# EAGLE design CNT_1_1 (EAGLE 8.3.2)
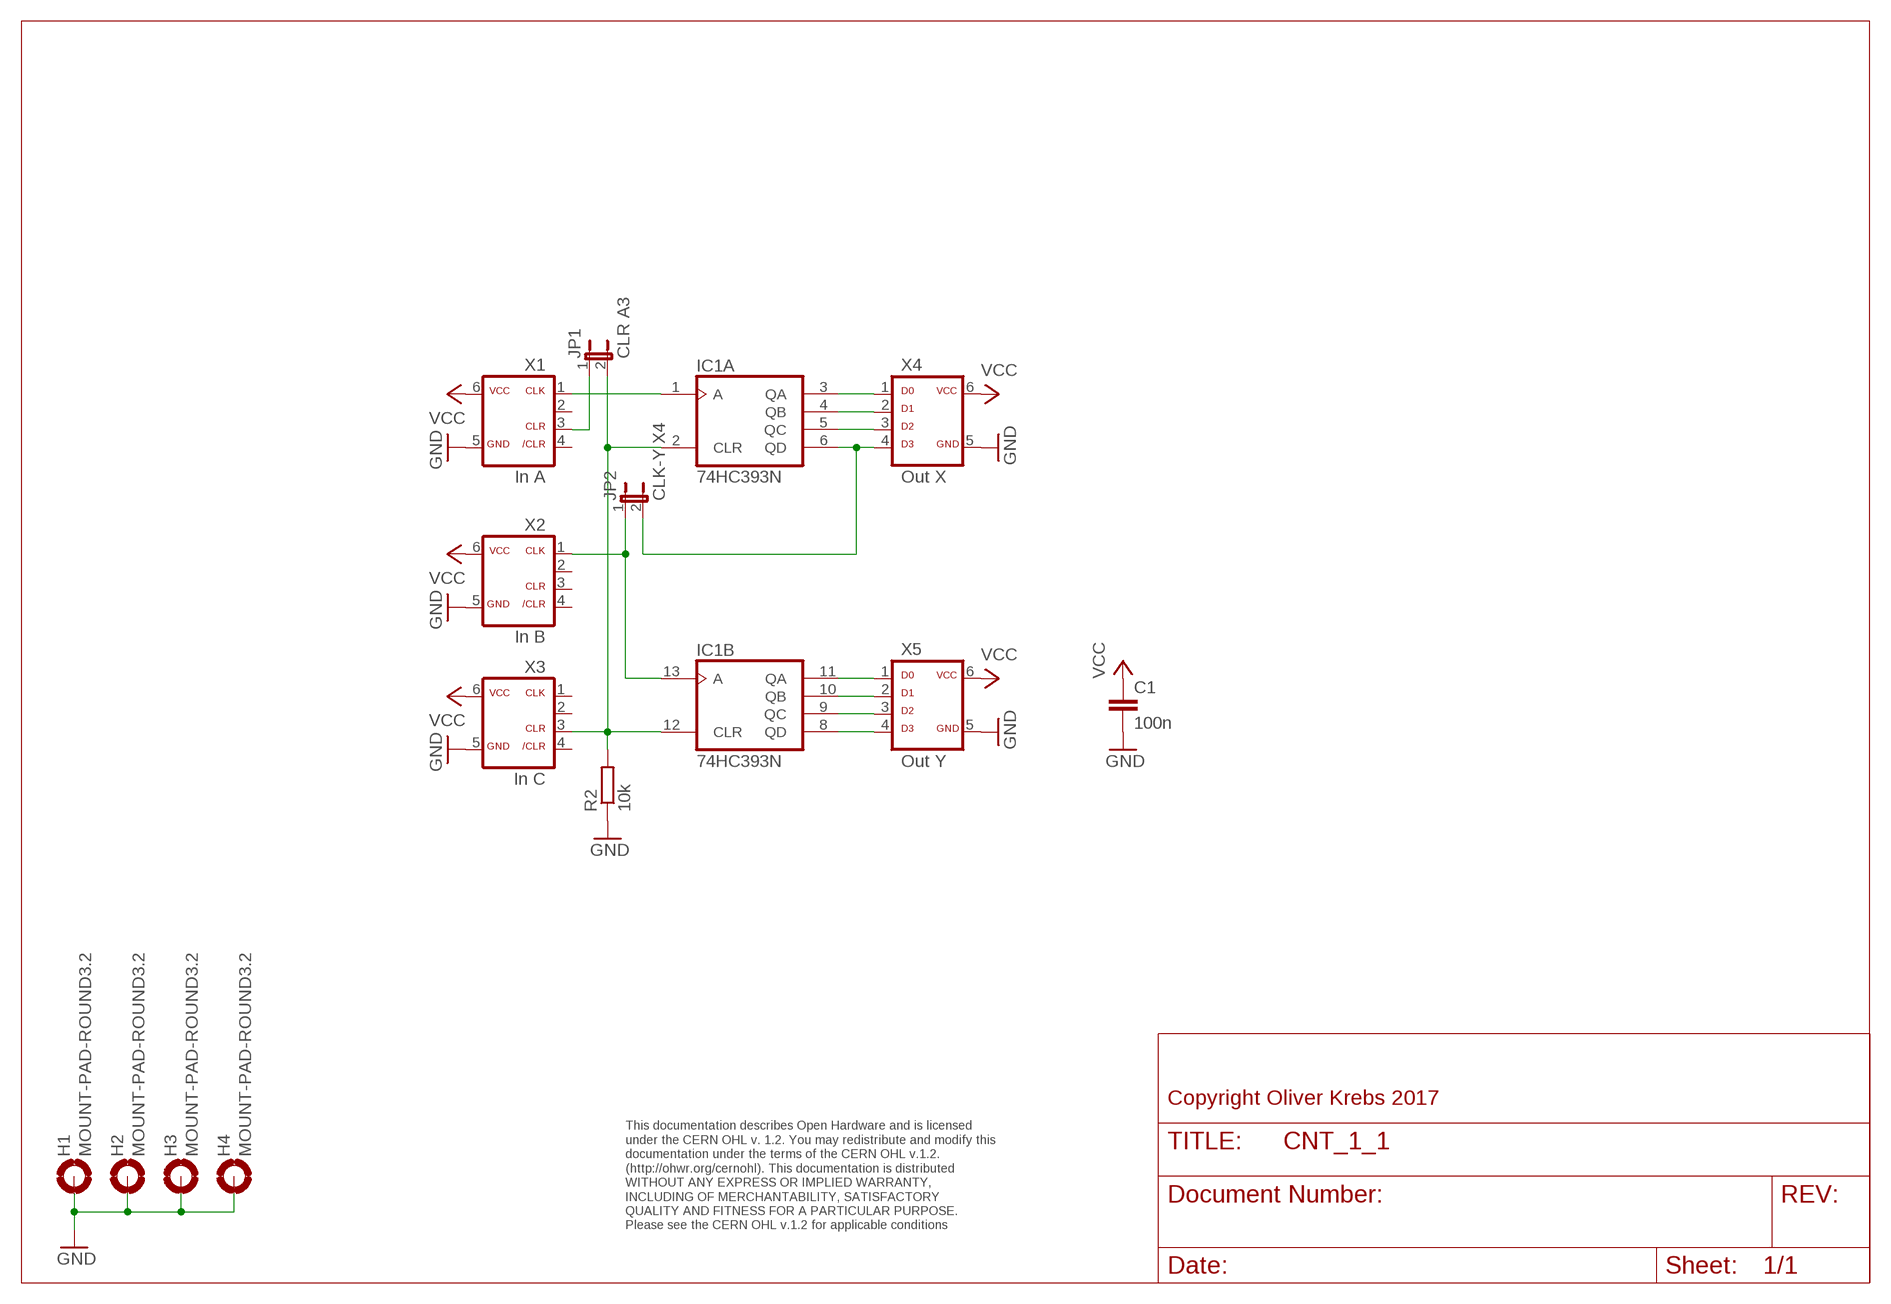
[diagram p0: schematic, sheet 1]

## Parts
C1  100n  C-EU050-025X075  [C050-025X075]
H1  MOUNT-PAD-ROUND3.2  [3,2-PAD]
H2  MOUNT-PAD-ROUND3.2  [3,2-PAD]
H3  MOUNT-PAD-ROUND3.2  [3,2-PAD]
H4  MOUNT-PAD-ROUND3.2  [3,2-PAD]
IC1  74HC393N  [DIL14]
JP1  CLR A3  JP1E  [JP1]
JP2  CLK-Y X4  JP1E  [JP1]
R2  10k  R-EU_0207/10  [0207/10]
X1  In A  ML6C  [ML-6]
X2  In B  ML6C  [ML-6]
X3  In C  ML6C  [ML-6]
X4  Out X  ML6D  [ML-6]
X5  Out Y  ML6D  [ML-6]

## Nets
GND: C1.2 H1.B3,2(MOUNT) H2.B3,2(MOUNT) H3.B3,2(MOUNT) H4.B3,2(MOUNT) R2.1 X1.5 X2.5 X3.5 X4.5 X5.5
N$1: IC1.3(A:QA) X4.1
N$2: IC1.4(A:QB) X4.2
N$3: IC1.5(A:QC) X4.3
N$5: IC1.1(A:A) X1.1
N$6: JP1.1 X1.3
N$7: IC1.6(A:QD) JP2.2 X4.4
N$9: IC1.2(A:CLR) IC1.12(B:CLR) JP1.2 R2.2 X3.3
N$11: IC1.13(B:A) JP2.1 X2.1
N$13: IC1.11(B:QA) X5.1
N$15: IC1.10(B:QB) X5.2
N$16: IC1.9(B:QC) X5.3
N$17: IC1.8(B:QD) X5.4
VCC: C1.1 X1.6 X2.6 X3.6 X4.6 X5.6
Unconnected: X1.2 X1.4 X2.2 X2.3 X2.4 X3.1 X3.2 X3.4

## Notes on the sheet
- Copyright Oliver Krebs 2017
- This documentation describes Open Hardware and is licensed 
  under the CERN OHL v. 1.2. You may redistribute and modify this 
  documentation under the terms of the CERN OHL v.1.2. 
  (http://ohwr.org/cernohl). This documentation is distributed
  WITHOUT ANY EXPRESS OR IMPLIED WARRANTY, 
  INCLUDING OF MERCHANTABILITY, SATISFACTORY 
  QUALITY AND FITNESS FOR A PARTICULAR PURPOSE. 
  Please see the CERN OHL v.1.2 for applicable conditions

## Power pins joined to a net without a drawn wire
GND: IC1.7(P:GND)
VCC: IC1.14(P:VCC)

## Library data of the parts
C1 = 01-my_rcl:C-EU: CAPACITOR, European symbol
H1-H4 = holes:MOUNT-PAD-ROUND: MOUNTING PAD, round
IC1 = 74xx-eu:74*393: Dual 4-bit decade and binary COUNTER
JP1 JP2 = jumper:JP1E: JUMPER
R2 = 01-my_rcl:R-EU_: RESISTOR, European symbol
X1-X3 = 01-my-con:ML6C
X4 X5 = 01-my-con:ML6D

## Board
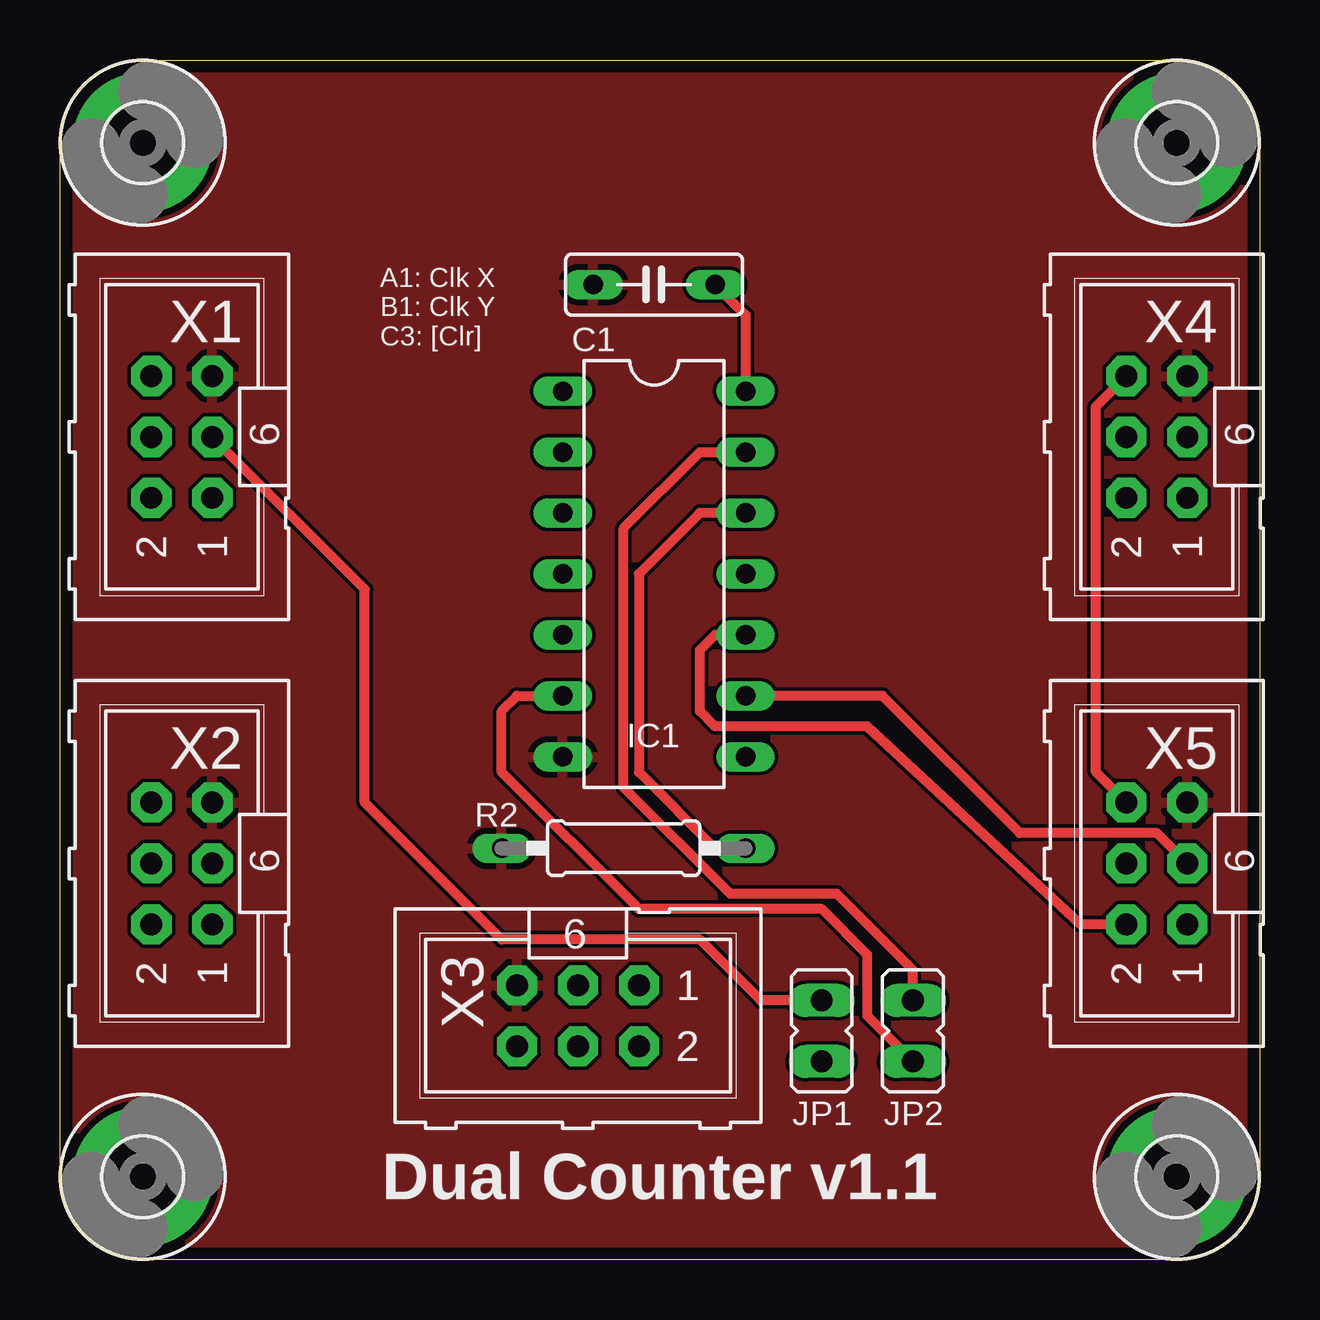
[diagram p1: board, top side]
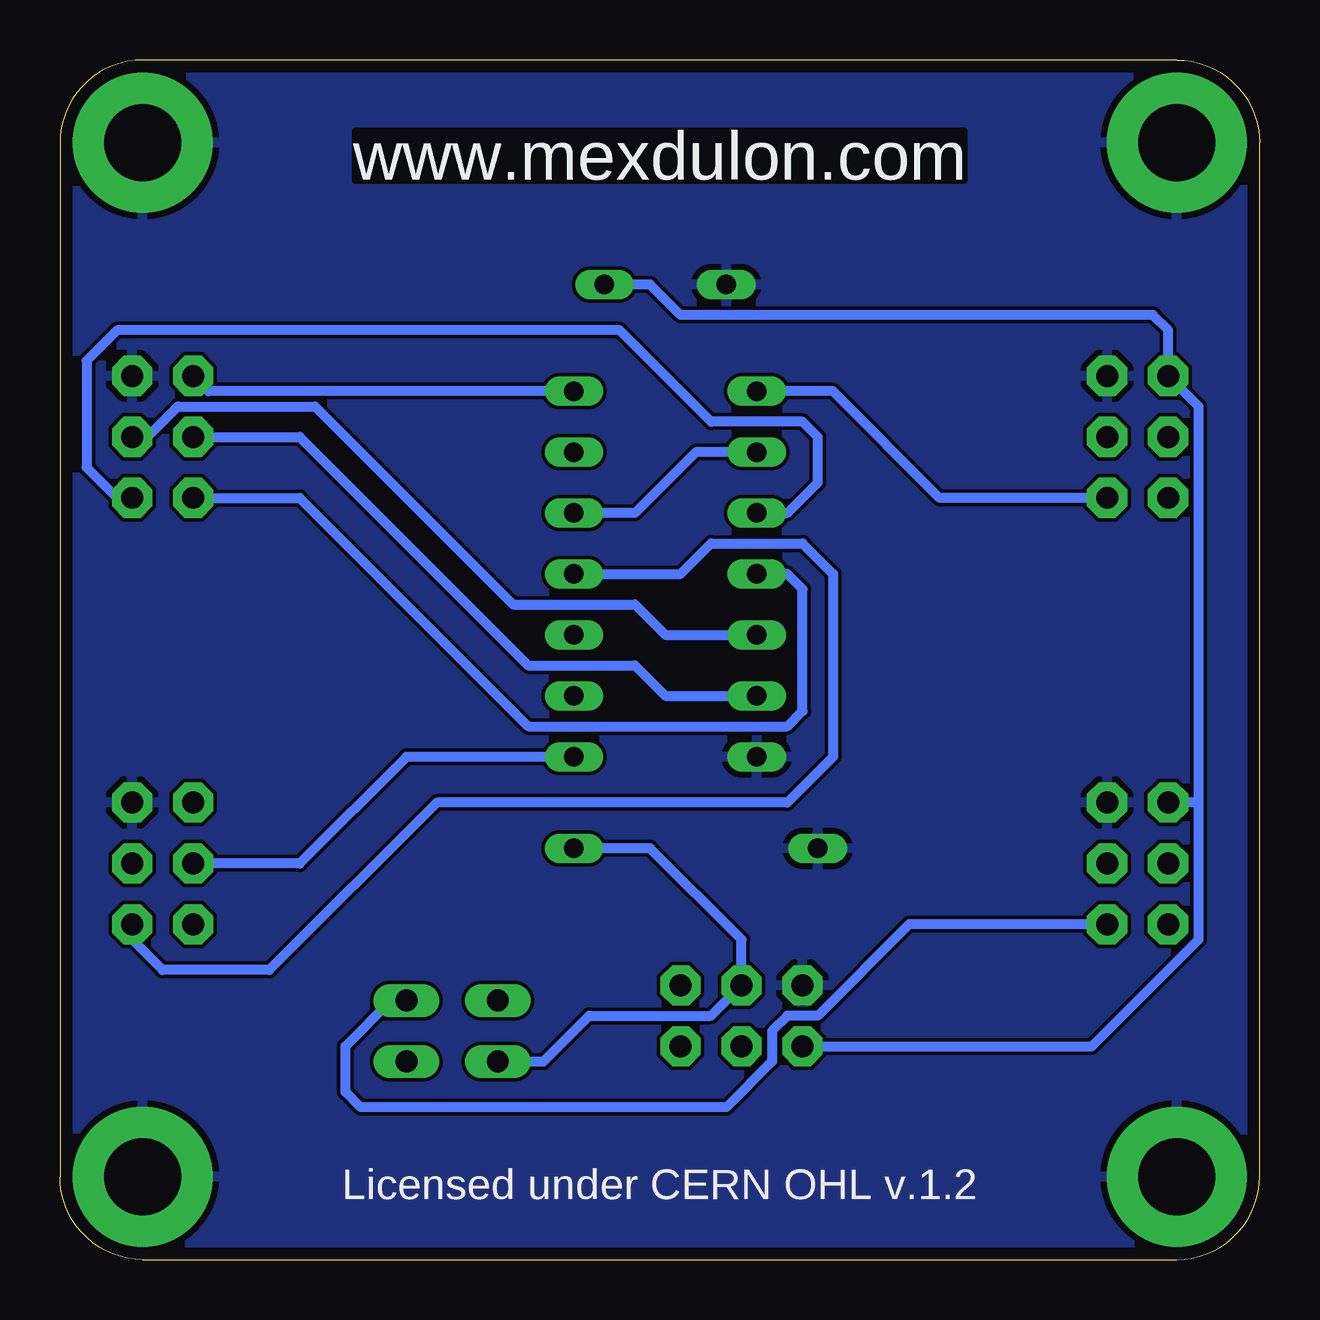
[diagram p2: board, bottom side, seen from below]

Size 50 x 50 mm. Coordinates in mm from the lower left corner, seen from the top.
Outline: 0,3.45 0,46.55 arc-90 3.45,50 46.55,50 arc-90 50,46.55 50,3.45 arc-90 46.55,0 3.45,0 arc-90 0,3.45
Copper layers (1*16): Top 0.035mm / dielectric 1.6mm / Bottom 0.035mm
Design rules "Elecrow_2-layer_PCB_eagle_rule": minimum track width 6mil, minimum drill 12mil, track to track 6mil, track to pad 6mil, pad to pad 6mil, via to via 8mil, smd to smd 0mil, copper to edge 20mil, drill to drill 10mil, minimum pad ring 6mil, minimum via ring 6mil, stop-mask expansion 0mil, vias tented up to drill 100mil, thermal gap 10mil

### Footprints (pad centres in the part's own frame; a part is rotated, then mirrored left to right if it is on the bottom)
C050-025X075 = drill 0.813 long: 1 -2.54,0; 2 2.54,0
3,2-PAD = drill 3.2 pad 5.842: B3,2 0,0
DIL14 = drill 0.813 long: 1 -7.62,-3.81; 2 -5.08,-3.81; 3 -2.54,-3.81; 4 0,-3.81; 5 2.54,-3.81; 6 5.08,-3.81; 7 7.62,-3.81; 8 7.62,3.81; 9 5.08,3.81; 10 2.54,3.81; 11 0,3.81; 12 -2.54,3.81; 13 -5.08,3.81; 14 -7.62,3.81
JP1 = drill 0.914 long: 1 0,-1.27; 2 0,1.27
0207/10 = drill 0.813 long: 1 -5.08,0; 2 5.08,0
ML-6 = drill 0.914 pad 1.676 octagon: 1 -2.54,-1.27; 2 -2.54,1.27; 3 0,-1.27; 4 0,1.27; 5 2.54,-1.27; 6 2.54,1.27

### Placement (x,y rotation side)
C1  24.77,40.64 180 top
H1  3.45,46.55 0 top
H2  3.45,3.45 0 top
H3  46.55,3.45 0 top
H4  46.55,46.55 0 top
IC1  24.77,28.57 270 top
JP1  31.75,9.53 180 top
JP2  35.56,9.53 180 top
R2  23.5,17.14 0 top
X1  5.08,34.29 90 top
X2  5.08,16.51 90 top
X3  21.59,10.16 180 top
X4  45.72,34.29 90 top
X5  45.72,16.51 90 top

### Tracks (layer width: path | path; a pad name or v marks a point on that pad's centre or on a via)
GND
  pour Bottom: 0,50.16 50.16,50.16 50.16,0 0,0
  pour Top: 0,50.16 50.16,50.16 50.16,0 0,0
N$1
  Bottom 0.406: IC1.3 19.68,31.11 18.41,32.38 18.41,34.29 19.05,34.92 22.86,34.92 26.67,38.73 47.62,38.73 48.9,37.47 48.9,33.02 47.62,31.75 X4.1
N$2
  Bottom 0.406: X4.2 40.01,31.75 30.48,22.23 19.68,22.23 19.05,22.86 19.05,27.94 19.68,28.57 IC1.4
N$3
  Bottom 0.406: X4.3 46.35,34.29 45.09,35.56 39.37,35.56 31.11,27.3 26.04,27.3 24.77,26.04 IC1.5
N$5
  Bottom 0.406: X1.1 13.34,31.75 17.78,36.2 IC1.1
N$6
  Top 0.406: JP1.1 29.21,10.79 26.67,13.34 18.41,13.34 12.7,19.05 12.7,27.94 X1.3
N$7
  Top 0.406: JP2.2 33.66,10.16 33.66,12.7 31.75,14.61 24.13,14.61 18.41,20.32 18.41,22.86 19.05,23.5 IC1.6
  Bottom 0.406: X4.4 40.01,34.29 30.48,24.77 26.04,24.77 24.77,23.5 IC1.6
N$9
  Top 0.406: IC1.12 26.67,31.11 24.13,28.57 24.13,20.32 27.3,17.14 R2.2
  Bottom 0.406: IC1.2 23.5,33.66 26.04,31.11 IC1.12 | R2.2 25.4,17.14 21.59,13.34 X3.3 22.86,10.16 27.94,10.16 29.84,8.26 JP1.2
N$11
  Top 0.406: JP2.1 35.56,12.06 32.38,15.24 27.94,15.24 23.5,19.68 23.5,30.48 26.67,33.66 IC1.13
  Bottom 0.406: X2.1 14.61,13.97 18.41,10.16 19.68,10.16 20.32,9.53 20.32,8.26 22.23,6.35 37.47,6.35 38.1,6.99 38.1,8.89 36.2,10.79 JP2.1
N$13
  Bottom 0.406: IC1.11 24.13,28.57 22.86,29.84 19.05,29.84 17.78,28.57 17.78,20.95 19.68,19.05 34.29,19.05 41.27,12.06 45.72,12.06 46.99,13.34 X5.1
N$15
  Top 0.406: X5.2 42.55,13.97 33.66,22.23 27.3,22.23 26.67,22.86 26.67,25.4 27.3,26.04 IC1.10
N$16
  Top 0.406: X5.3 45.72,17.78 40.01,17.78 34.29,23.5 IC1.9
N$17
  Bottom 0.406: IC1.8 35.56,20.95 40.01,16.51 X5.4
VCC
  Top 0.406: C1.1 28.57,39.37 IC1.14 | X5.6 43.18,20.32 43.18,35.56 X4.6
  Bottom 0.406: IC1.14 43.81,36.2 X4.6 | C1.1 25.4,40.64 24.13,39.37 4.45,39.37 3.81,38.73 X1.6 2.54,35.56 2.54,19.05 | X3.6 6.99,8.89 2.54,13.34 2.54,19.05 | 2.54,19.05 X2.6

### Text on the board
Bottom: www.mexdulon.com
tNames: A1: Clk X / B1: Clk Y / C3: [Clr] | Dual Counter v1.1
bNames: www.mexdulon.com | Licensed under CERN OHL v.1.2
200bmp: E:/Bilder/Elektronik/Modulion/Mexdulon/mexdulon_50x50_pcb.bmp